# Altium project SB13ECU_EVL_V01_14031129.PrjPcb
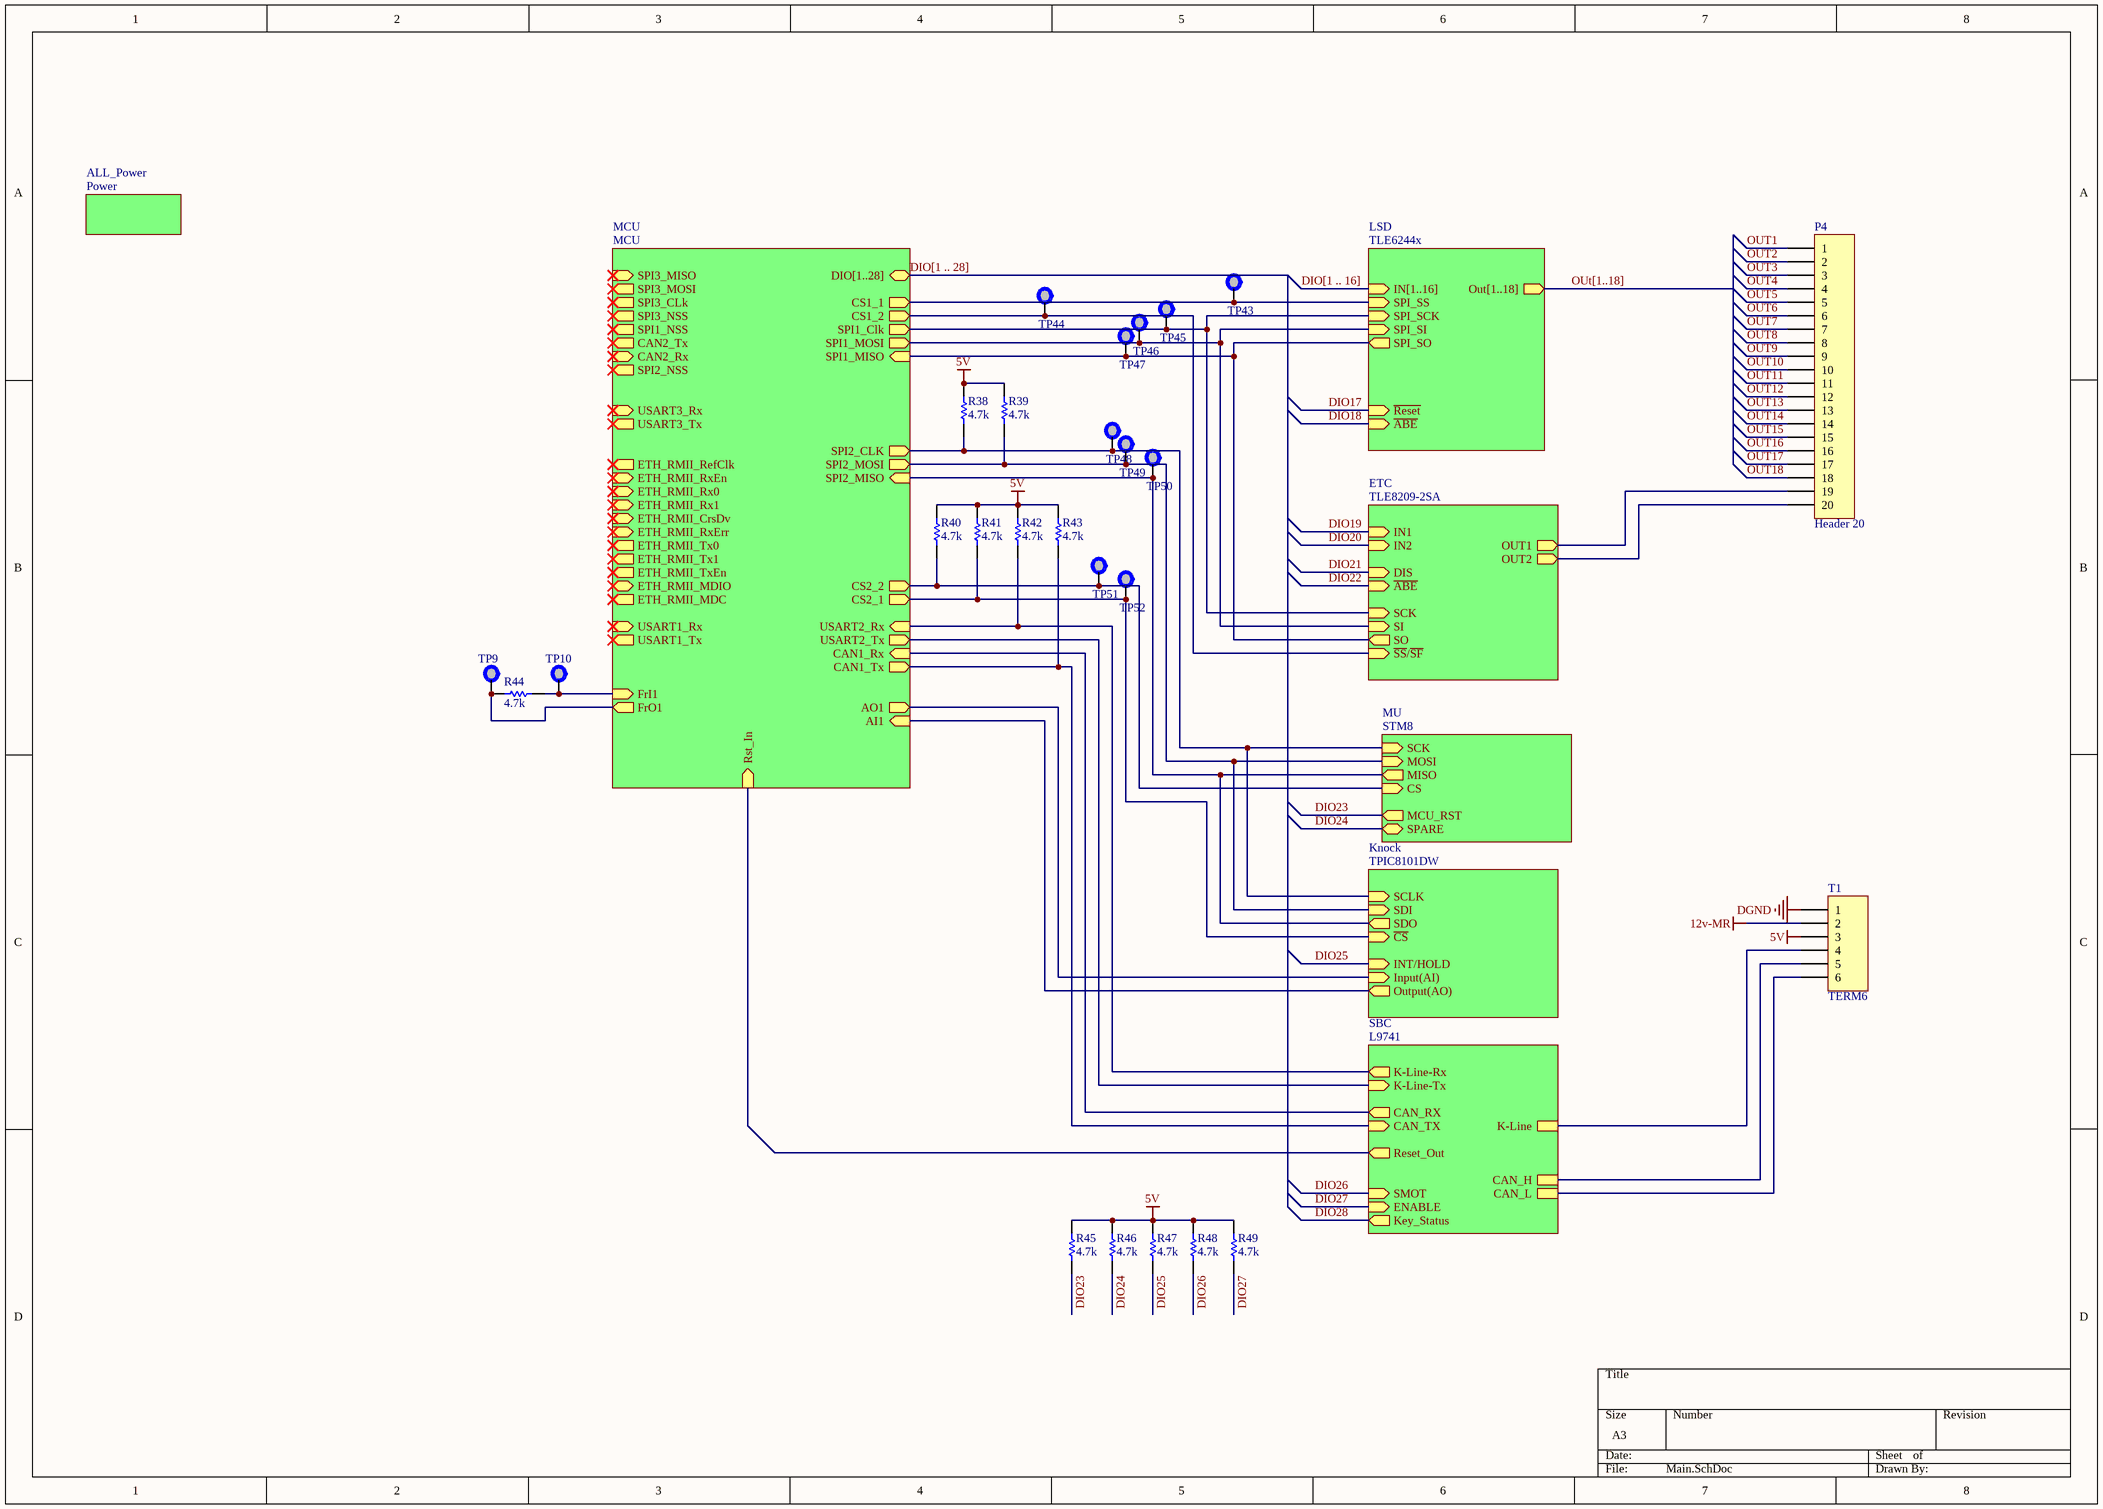
[diagram p0: Main.SchDoc]
8 sheets, 220 parts. Net scope: hierarchical (ports join the sheet entries above them; power ports are global).
Board file: SB13ECU_EVL_V01_14031129.PcbDoc
Sheets:
  Main.SchDoc
    MCU = MCU.SchDoc
    Knock = TPIC8101DW.SchDoc
    LSD = TLE6244x.SchDoc
    SBC = L9741.SchDoc
    ALL_Power = Power.SchDoc
    ETC = TLE8209-2SA.SchDoc
    MU = STM8.SchDoc

## Sheet Main.SchDoc
size A3; SheetNumber: 1; SheetTotal: 8; SPICEModelCacheTOCTCHPD: <root> / <DocumentId>TOCTCHPD</DocumentId> / </root>

### Parts
P4  Header 20  [HDR1X20]
R38  4.7K  [0805]
R39  4.7K  [0805]
R40  4.7K  [0805]
R41  4.7K  [0805]
R42  4.7K  [0805]
R43  4.7K  [0805]
R44  4.7K  [0805]
R45  4.7K  [0805]
R46  4.7K  [0805]
R47  4.7K  [0805]
R48  4.7K  [0805]
R49  4.7K  [0805]
T1  TERM6  [TERM6]
TP9  TestPoint  [TP]  (value not drawn)
TP10  TestPoint  [TP]  (value not drawn)
TP43  TestPoint  [TP]  (value not drawn)
TP44  TestPoint  [TP]  (value not drawn)
TP45  TestPoint  [TP]  (value not drawn)
TP46  TestPoint  [TP]  (value not drawn)
TP47  TestPoint  [TP]  (value not drawn)
TP48  TestPoint  [TP]  (value not drawn)
TP49  TestPoint  [TP]  (value not drawn)
TP50  TestPoint  [TP]  (value not drawn)
TP51  TestPoint  [TP]  (value not drawn)
TP52  TestPoint  [TP]  (value not drawn)

### Sub-sheets
ALL_Power = Power: no entries
ETC = TLE8209-2SA: IN1 (in), IN2 (in), DIS (in), ~{ABE} (in), SCK (in), SI (in), SO (out), ~{SS}/~{SF} (in), OUT1 (out), OUT2 (out)
Knock = TPIC8101DW: Output(AO) (out), SCLK (in), SDI (in), SDO (out), ~{CS} (in), INT/HOLD (in), Input(AI) (in)
LSD = TLE6244x: IN[1..16] (in), SPI_SS (in), SPI_SO (out), SPI_SCK (in), SPI_SI (in), ~{Reset} (in), ~{ABE} (in), Out[1..18] (out)
MCU = MCU: DIO[1..28] (bidir), ETH_RMII_RefClk (out), ETH_RMII_MDIO (bidir), ETH_RMII_CrsDv (in), ETH_RMII_RxErr (in), ETH_RMII_MDC (out), ETH_RMII_Rx0 (in), ETH_RMII_Rx1 (in), ETH_RMII_TxEn (out), ETH_RMII_RxEn (in), ETH_RMII_Tx0 (out), ETH_RMII_Tx1 (out), SPI1_Clk (out), SPI1_MISO (in), SPI1_MOSI (out), SPI1_NSS (out), SPI2_NSS (out), SPI2_CLK (out), SPI2_MOSI (out), SPI2_MISO (in), SPI3_MISO (in), SPI3_MOSI (out), SPI3_CLk (out), SPI3_NSS (out), CAN1_Rx (in), CAN1_Tx (out), CAN2_Tx (out), CAN2_Rx (in), USART1_Rx (in), USART1_Tx (out), USART2_Tx (out), USART2_Rx (in), USART3_Rx (in), USART3_Tx (out), AI1 (in), AO1 (out), CS1_1 (out), CS1_2 (out), CS2_1 (out), CS2_2 (out), Rst_In (in), FrI1 (in), FrO1 (out)
MU = STM8: SCK (in), MISO (out), MOSI (in), CS (in), MCU_RST (out), SPARE (bidir)
SBC = L9741: K-Line-Rx (out), K-Line-Tx (in), CAN_RX (out), CAN_TX (in), CAN_L, CAN_H, Reset_Out (out), SMOT (in), K-Line, ENABLE (in), Key_Status (out)

### Nets
5V: R38.2 R39.2 R40.1 R41.2 R42.2 R43.2 R45.1 R46.1 R47.1 R48.1 R49.1 T1.3
12v-MR: T1.2
DGND: T1.1
DIO23: R45.2 ; sheet MU/MCU_RST
DIO24: R46.2 ; sheet MU/SPARE
DIO25: R47.2 ; sheet Knock/INT/HOLD
DIO26: R48.2 ; sheet SBC/SMOT
DIO27: R49.2 ; sheet SBC/ENABLE
OUT1: P4.1
OUT2: P4.2
OUT3: P4.3
OUT4: P4.4
OUT5: P4.5
OUT6: P4.6
OUT7: P4.7
OUT8: P4.8
OUT9: P4.9
OUT10: P4.10
OUT11: P4.11
OUT12: P4.12
OUT13: P4.13
OUT14: P4.14
OUT15: P4.15
OUT16: P4.16
OUT17: P4.17
OUT18: P4.18
NetC25_1: sheet MCU/AO1, sheet Knock/Input(AI)
NetC32_1: T1.4 ; sheet SBC/K-Line
NetP4_19: P4.19 ; sheet ETC/OUT1
NetP4_20: P4.20 ; sheet ETC/OUT2
NetR2_1: sheet MCU/Rst_In, sheet SBC/Reset_Out
NetR17_1: sheet MCU/AI1, sheet Knock/Output(AO)
NetR38_1: R38.1 TP48.1 ; sheet MCU/SPI2_CLK, sheet Knock/SCLK, sheet MU/SCK
NetR39_1: R39.1 TP49.1 ; sheet MCU/SPI2_MOSI, sheet Knock/SDI, sheet MU/MOSI
NetR40_2: R40.2 TP51.1 ; sheet MCU/CS2_2, sheet MU/CS
NetR41_1: R41.1 TP52.1 ; sheet MCU/CS2_1, sheet Knock/~{CS}
NetR42_1: R42.1 ; sheet MCU/USART2_Rx, sheet SBC/K-Line-Rx
NetR43_1: R43.1 ; sheet MCU/CAN1_Tx, sheet SBC/CAN_TX
NetR44_1: R44.1 TP9.1 ; sheet MCU/FrO1
NetR44_2: R44.2 TP10.1 ; sheet MCU/FrI1
NetR57_2: T1.6 ; sheet SBC/CAN_L
NetR58_2: T1.5 ; sheet SBC/CAN_H
NetTP43_1: TP43.1 ; sheet MCU/CS1_1, sheet LSD/SPI_SS
NetTP44_1: TP44.1 ; sheet MCU/CS1_2, sheet ETC/~{SS}/~{SF}
NetTP45_1: TP45.1 ; sheet MCU/SPI1_Clk, sheet LSD/SPI_SCK, sheet ETC/SCK
NetTP46_1: TP46.1 ; sheet MCU/SPI1_MOSI, sheet LSD/SPI_SI, sheet ETC/SI
NetTP47_1: TP47.1 ; sheet MCU/SPI1_MISO, sheet LSD/SPI_SO, sheet ETC/SO
NetTP50_1: TP50.1 ; sheet MCU/SPI2_MISO, sheet Knock/SDO, sheet MU/MISO
NetTP54_1: sheet MCU/USART2_Tx, sheet SBC/K-Line-Tx
NetTP59_1: sheet MCU/CAN1_Rx, sheet SBC/CAN_RX

### Buses and harness runs
bus DIO[1 .. 16] = sheet LSD/IN[1..16]
bus DIO[1 .. 28] = sheet MCU/DIO[1..28]
bus OUt[1..18] = sheet LSD/Out[1..18]

### Library data of the parts
P4 = Header 20: Header, 20-Pin; LatestRevisionDate: 17-Jul-2002; LatestRevisionNote: Re-released for DXP Platform.; Publisher: Altium Limited
R38-R49 = Res1: Resistor; Published: 8-Jun-2000; LatestRevisionDate: 17-Jul-2002; LatestRevisionNote: Re-released for DXP Platform.; PackageReference: AXIAL-0.3; Publisher: Altium Limited; PackageDescription: Axial Device, Thru-Hole; 2 Leads; 0.3 in Pin Spacing; Value: 4.7k
T1 = MHDR1X6: Header, 6-Pin; LatestRevisionDate: 17-Jul-2002; LatestRevisionNote: Re-released for DXP Platform.; Publisher: Altium Limited

## Sheet MCU.SchDoc
size A4; SheetNumber: 2; SheetTotal: 8; SPICEModelCacheNGFSRWWY: <root> / <DocumentId>NGFSRWWY</DocumentId> / <CacheFrame Number="0"> / <Model Name="led0" Kind="MDL"> / <Text>*Typ INFRARED GaAs LED: Vf=1.2V Vr=5V If=40mA trr=3uS / *LED Pinout: 1=A, 2=K / .MODEL LED0 D (IS=93.5P RS=84M N=2.63 BV=5 IBV=10U / + CJO=2.97P VJ=.75 M=.333 TT=4.32U)</Text> / </Model> / <Model Name="dpsw2" Kind="CKT"> / <Text>* DIP switch 2 / * jjt 19/6/2002: created / * / *             Switch connections: / *             sw1 / *             |  |  sw2 / *             |  |  |  | / *             |  |  |  | / .subckt dpsw2 1  2  4  5 / + PARAMS: STATE1=0 STATE2=0 RON=1m ROFF=100E6 / * / V1 3 0 {STATE1} / V2 6 0 {STATE2} / * / SDIP1 1 2 3 0 DIPMOD / SDIP2 4 5 6 0 DIPMOD / * / .MODEL DIPMOD SW(VT=0.5 RON={RON} ROFF={ROFF}) / .ends dpsw2</Text> / </Model> / </CacheFrame> / </root>
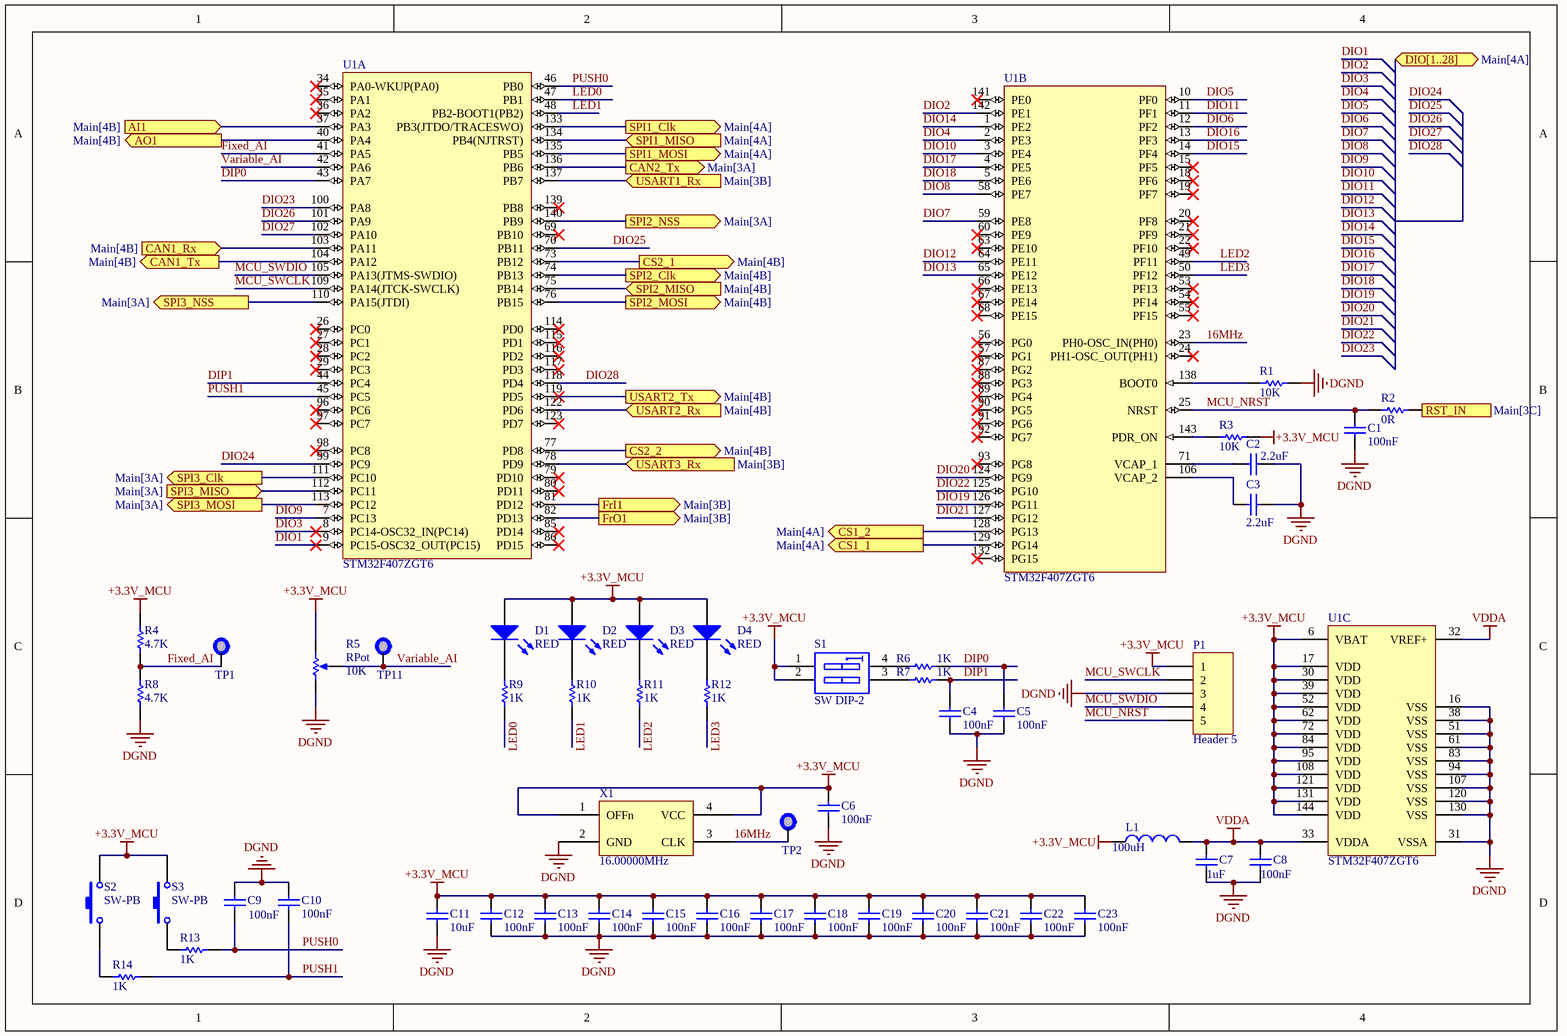
[diagram p1: MCU.SchDoc]

### Parts
C1  100nF  [0603c]
C2  2.2uF  [0805C]
C3  2.2uF  [0805C]
C4  100nF  [0603c]
C5  100nF  [0603c]
C6  100nF  [0603C]
C7  1uF  [0805C]
C8  100nF  [0603C]
C9  100nF  [0603c]
C10  100nF  [0603c]
C11  value 10uF  [1206C]  (hidden comment: 10uf/50V)
C12  100nF  [0603c]
C13  100nF  [0603c]
C14  100nF  [0603c]
C15  100nF  [0603c]
C16  100nF  [0603c]
C17  100nF  [0603c]
C18  100nF  [0603c]
C19  100nF  [0603c]
C20  100nF  [0603c]
C21  100nF  [0603c]
C22  100nF  [0603c]
C23  100nF  [0603c]
D1  RED  [0805LED]
D2  RED  [0805LED]
D3  RED  [0805LED]
D4  RED  [0805LED]
L1  100uH  [0805FB]
P1  Header 5  [HDR1X5]
R1  10K  [0805]
R2  0R  [0805]
R3  10K  [0805]
R4  4.7K  [0805]
R5  RPot  value 10K  [POT-MULTITURN]
R6  1K  [0805]
R7  1K  [0805]
R8  4.7K  [0805]
R9  1K  [0805]
R10  1K  [0805]
R11  1K  [0805]
R12  1K  [0805]
R13  1K  [0805]
R14  1K  [0805]
S1  SW DIP-2  [DIP-4]
S2  SW-PB  [PUSHBUTTON-SMD]
S3  SW-PB  [PUSHBUTTON-SMD]
TP1  TestPoint  [TP]  (value not drawn)
TP2  TestPoint  [TP]  (value not drawn)
TP11  TestPoint  [TP]  (value not drawn)
U1  STM32F407ZGT6  [STM-LQFP144_N]  (parts A,B,C of 3)
X1  value 16.00000MHz  [OSC-SMT]  (hidden comment: SG-8018CB 16.000000 MHZ TJHPA)

### Ports
AI1 (in, see Main[4B]), AO1 (out, see Main[4B]), CAN1_Rx (in, see Main[4B]), CAN1_Tx (out, see Main[4B]), CAN2_Tx (out, see Main[3A]), CS1_1 (out, see Main[4A]), CS1_2 (out, see Main[4A]), CS2_1 (out, see Main[4B]), CS2_2 (out, see Main[4B]), DIO[1..28] (bidir, see Main[4A]), FrI1 (out, see Main[3B]), FrO1 (out, see Main[3B]), RST_IN (in, see Main[3C]), SPI1_Clk (out, see Main[4A]), SPI1_MISO (in, see Main[4A]), SPI1_MOSI (out, see Main[4A]), SPI2_Clk (out, see Main[4B]), SPI2_MISO (in, see Main[4B]), SPI2_MOSI (out, see Main[4B]), SPI2_NSS (out, see Main[3A]), SPI3_Clk (out, see Main[3A]), SPI3_MISO (in, see Main[3A]), SPI3_MOSI (out, see Main[3A]), SPI3_NSS (out, see Main[3A]), USART1_Rx (in, see Main[3B]), USART2_Rx (in, see Main[4B]), USART2_Tx (out, see Main[4B]), USART3_Rx (in, see Main[3B])

### Nets
+3.3V_MCU: C6.1 C11.2 C12.1 C13.1 C14.1 C15.1 C16.1 C17.1 C18.1 C19.1 C20.1 C21.1 C22.1 C23.1 D1.1(A) D2.1(A) D3.1(A) D4.1(A) L1.1 P1.1 R3.1 R4.2 R5.3(BOT) S1.1(A1) S1.2(A2) S2.2 S3.2 U1.6(VBAT) U1.17(VDD) U1.30(VDD) U1.39(VDD) U1.52(VDD) U1.62(VDD) U1.72(VDD) U1.84(VDD) U1.95(VDD) U1.108(VDD) U1.121(VDD) U1.131(VDD) U1.144(VDD) X1.1(OFFn) X1.4(VCC)
DGND: C1.2 C2.2 C3.2 C4.2 C5.2 C6.2 C7.1 C8.1 C9.1 C10.1 C11.1 C12.2 C13.2 C14.2 C15.2 C16.2 C17.2 C18.2 C19.2 C20.2 C21.2 C22.2 C23.2 P1.3 R1.1 R5.1(TOP) R8.1 U1.16(VSS) U1.31(VSSA) U1.38(VSS) U1.51(VSS) U1.61(VSS) U1.83(VSS) U1.94(VSS) U1.107(VSS) U1.120(VSS) U1.130(VSS) X1.2(GND)
VDDA: C7.2 C8.2 L1.2 U1.32(VREF+) U1.33(VDDA)
16MHz: TP2.1 U1.23(PH0-OSC_IN(PH0)) X1.3(CLK)
DIO1: U1.9(PC15-OSC32_OUT(PC15))
DIO2: U1.142(PE1)
DIO3: U1.8(PC14-OSC32_IN(PC14))
DIO4: U1.2(PE3)
DIO5: U1.10(PF0)
DIO6: U1.12(PF2)
DIO7: U1.59(PE8)
DIO8: U1.58(PE7)
DIO9: U1.7(PC13)
DIO10: U1.3(PE4)
DIO11: U1.11(PF1)
DIO12: U1.64(PE11)
DIO13: U1.65(PE12)
DIO14: U1.1(PE2)
DIO15: U1.14(PF4)
DIO16: U1.13(PF3)
DIO17: U1.4(PE5)
DIO18: U1.5(PE6)
DIO19: U1.126(PG11)
DIO20: U1.124(PG9)
DIO21: U1.127(PG12)
DIO22: U1.125(PG10)
DIO23: U1.100(PA8)
DIO24: U1.99(PC9)
DIO25: U1.70(PB11)
DIO26: U1.101(PA9)
DIO27: U1.102(PA10)
DIO28: U1.118(PD4)
DIP0: C5.1 R6.2 U1.43(PA7)
DIP1: C4.1 R7.2 U1.44(PC4)
Fixed_AI: R4.1 R8.2 TP1.1 U1.41(PA5)
LED0: R9.1 U1.47(PB1)
LED1: R10.1 U1.48(PB2-BOOT1(PB2))
LED2: R11.1 U1.49(PF11)
LED3: R12.1 U1.50(PF12)
MCU_NRST: C1.1 P1.5 R2.2 U1.25(NRST)
MCU_SWCLK: P1.2 U1.109(PA14(JTCK-SWCLK))
MCU_SWDIO: P1.4 U1.105(PA13(JTMS-SWDIO))
PUSH0: C9.2 R13.2 U1.46(PB0)
PUSH1: C10.2 R14.1 U1.45(PC5)
Variable_AI: R5.2(TAP) TP11.1 U1.42(PA6)
NetC2_1: C2.1 U1.71(VCAP_1)
NetC3_1: C3.1 U1.106(VCAP_2)
NetC25_1: U1.40(PA4) ; port AO1
NetD1_2: D1.2(K) R9.2
NetD2_2: D2.2(K) R10.2
NetD3_2: D3.2(K) R11.2
NetD4_2: D4.2(K) R12.2
NetR1_2: R1.2 U1.138(BOOT0)
NetR2_1: R2.1 ; port RST_IN
NetR3_2: R3.2 U1.143(PDR_ON)
NetR6_1: R6.1 S1.4(B1)
NetR7_1: R7.1 S1.3(B2)
NetR13_1: R13.1 S3.1
NetR14_2: R14.2 S2.1
NetR17_1: U1.37(PA3) ; port AI1
NetR38_1: U1.74(PB13) ; port SPI2_Clk
NetR39_1: U1.76(PB15) ; port SPI2_MOSI
NetR40_2: U1.77(PD8) ; port CS2_2
NetR41_1: U1.73(PB12) ; port CS2_1
NetR42_1: U1.122(PD6) ; port USART2_Rx
NetR43_1: U1.104(PA12) ; port CAN1_Tx
NetR44_1: U1.82(PD13) ; port FrO1
NetR44_2: U1.81(PD12) ; port FrI1
NetTP43_1: U1.129(PG14) ; port CS1_1
NetTP44_1: U1.128(PG13) ; port CS1_2
NetTP45_1: U1.133(PB3(JTDO/TRACESWO)) ; port SPI1_Clk
NetTP46_1: U1.135(PB5) ; port SPI1_MOSI
NetTP47_1: U1.134(PB4(NJTRST)) ; port SPI1_MISO
NetTP50_1: U1.75(PB14) ; port SPI2_MISO
NetTP54_1: U1.119(PD5) ; port USART2_Tx
NetTP59_1: U1.103(PA11) ; port CAN1_Rx
NetU1_78: U1.78(PD9) ; port USART3_Rx
NetU1_110: U1.110(PA15(JTDI)) ; port SPI3_NSS
NetU1_111: U1.111(PC10) ; port SPI3_Clk
NetU1_112: U1.112(PC11) ; port SPI3_MISO
NetU1_113: U1.113(PC12) ; port SPI3_MOSI
NetU1_136: U1.136(PB6) ; port CAN2_Tx
NetU1_137: U1.137(PB7) ; port USART1_Rx
NetU1_140: U1.140(PB9) ; port SPI2_NSS

Not connected (* = marked no-connect by the designer): U1 15(PF5)* 18(PF6)* 19(PF7)* 20(PF8)* 21(PF9)* 22(PF10)* 24(PH1-OSC_OUT(PH1))* 26(PC0)* 27(PC1)* 28(PC2)* 29(PC3)* 34(PA0-WKUP(PA0))* 35(PA1)* 36(PA2)* 53(PF13)* 54(PF14)* 55(PF15)* 56(PG0)* 57(PG1)* 60(PE9)* 63(PE10)* 66(PE13)* 67(PE14)* 68(PE15)* 69(PB10)* 79(PD10)* 80(PD11)* 85(PD14)* 86(PD15)* 87(PG2)* 88(PG3)* 89(PG4)* 90(PG5)* 91(PG6)* 92(PG7)* 93(PG8)* 96(PC6)* 97(PC7)* 98(PC8)* 114(PD0)* 115(PD1)* 116(PD2)* 117(PD3)* 123(PD7)* 132(PG15)* 139(PB8)* 141(PE0)*

### Library data of the parts
C1-C23 = Cap: LOW ESR; Published: 8-Jun-2000; LatestRevisionDate: 17-Jul-2002; LatestRevisionNote: Re-released for DXP Platform.; PackageReference: RAD-0.3; Publisher: Altium Limited; PackageDescription: Radial Cap, Thru-Hole; 2 Leads; 0.3 in Pin Spacing
  C1 C4-C6 C8-C10 C12-C23: Value: 100nF
  C2 C3: Value: 2.2uF
  C7: Value: 1uF
D1-D4 = LED0: Published: 8-Jun-2000; LatestRevisionDate: 08-Jul-2005; LatestRevisionNote: Mech Layer 1 removed.; PackageReference: LED-0; Publisher: Altium Limited; PackageDescription: LED; 2 Leads
L1 = Inductor: Code_IEC: 1005; Value: BEAD(FCM1608KF-601T03); Published: 8-Jun-2000; LatestRevisionDate: 29-May-2009; LatestRevisionNote: IPC-7351 Footprint Added.; PackageReference: 0402-A; Publisher: Altium Limited; PackageDescription: Chip Inductor; Code_JEITA: 0402
P1 = Header 5: Header, 5-Pin; LatestRevisionDate: 17-Jul-2002; LatestRevisionNote: Re-released for DXP Platform.; Publisher: Altium Limited
R1-R4 R6-R14 = Res1: Resistor; Published: 8-Jun-2000; LatestRevisionDate: 17-Jul-2002; LatestRevisionNote: Re-released for DXP Platform.; PackageReference: AXIAL-0.3; Publisher: Altium Limited; PackageDescription: Axial Device, Thru-Hole; 2 Leads; 0.3 in Pin Spacing
  R1 R3: Value: 10K
  R2: Value: 0R
  R4 R8: Value: 4.7K
  R6 R7 R9-R14: Value: 1K
R5 = RPot: MultiTurn; Sim Note: Enter the Resistance value and the set point into parameter fields.; Set Position: 0.5; Published: 8-Jun-2000; LatestRevisionDate: 17-Jul-2002; LatestRevisionNote: Re-released for DXP Platform.; PackageReference: VR5; Publisher: Altium Limited; PackageDescription: Variable Resistor, Thru-Hole; 3 Leads
S1 = SW DIP-2: DIP Switch, 2 Position, SPST; Published: 24-Mar-1999; LatestRevisionDate: 17-Jul-2002; LatestRevisionNote: Re-released for DXP Platform.; PackageReference: DIP-4; Publisher: Altium Limited
S2 S3 = SW-PB: Switch; Published: 24-Mar-1999; LatestRevisionDate: 17-Jul-2002; LatestRevisionNote: Re-released for DXP Platform.; PackageReference: SPST-2; Publisher: Altium Limited; PackageDescription: Switch; 2 Leads
U1 = STM32F407ZGT6: ARM Cortex-M4 32-bit MCU+FPU, 210 DMIPS, 1024 kB Flash, 192 kB Internal RAM, 114 I/Os, 144-pin LQFP, -40 to 85 degC, Tray; Manufacturer: STMicroelectronics; D/A Converter: 2x12-bit; FLASH Size (Prog) (kB): 1024; I/Os (High Current): 114; Internal RAM Size (kB): 192; Operating Frequency(F) (Processor speed) (MHz): 168; Supply Voltage(Vcc) max (V): 3.6; Supply Voltage(Vcc) min (V): 1.8; DatasheetVersion: Rev. 4; PackageVersion: Rev. 4, 06/2013; PackageReference: LQFP144; PackageDescription: 144-Pin Low Profile Quad Flat Package, 20 x 20 mm Body, 0.5 mm Pitch; Supplier 1: Digi-Key; Supplier Part Number 1: 497-11766-ND; Supplier 2: Newark; Supplier Part Number 2: 73T2334; Supplier 3: Mouser; Supplier Part Number 3: 511-STM32F407ZGT6; Core: ARM Cortex-M4; Packing: Tray; Mounting Technology: Surface Mount; PartNumber: STM32F407ZGT6; ComponentLink1Description: Manufacturer URL; ComponentLink1URL: http://www.st.com/web/en/home.html; ComponentLink2Description: Datasheet; ComponentLink2URL: http://www.st.com/st-web-ui/static/active/en/resource/technical/document/datasheet/DM00037051.pdf; ComponentLink3Description: Package Specification; ComponentLink3URL: http://www.st.com/st-web-ui/static/active/en/resource/technical/document/datasheet/DM00037051.pdf
X1 = Oscillator

## Sheet TPIC8101DW.SchDoc
size A4; SheetNumber: 3; SheetTotal: 8; SPICEModelCacheOGXEDZQU: <root> / <DocumentId>OGXEDZQU</DocumentId> / <CacheFrame Number="0"> / <Model Name="xtal" Kind="CKT"> / <Text>*Generic type:crystal pkg:HC33/51 / .SUBCKT XTAL 1 2 PARAMS: FREQ=1Meg RS=750 C=13pf Q=1000 / LX 1 3 {((Q*RS)/(6.2831852*FREQ))} IC=0.5M / CX 3 4 {(1/(Q*6.2831852*FREQ*RS))} / C0 1 2 {C} / RS 4 2 {RS} / .ENDS XTAL</Text> / </Model> / </CacheFrame> / </root>
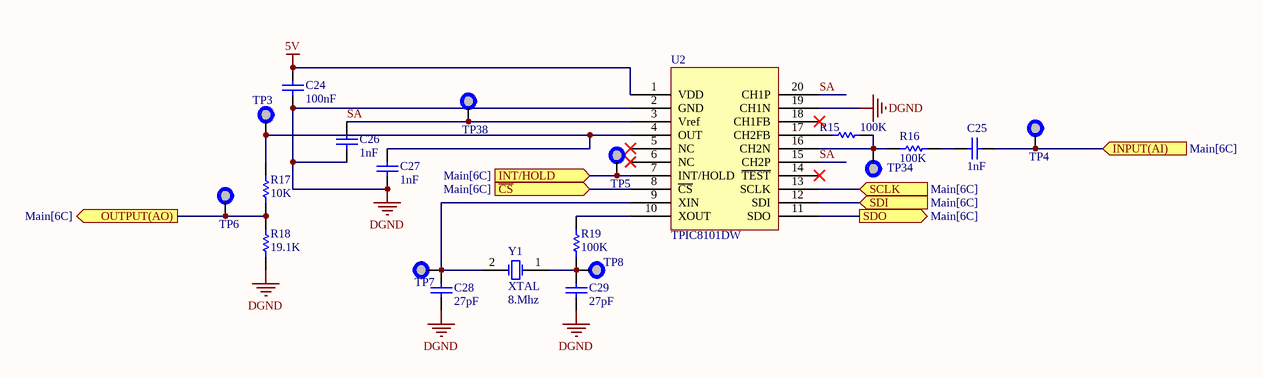
[diagram p2: TPIC8101DW.SchDoc]

### Parts
C24  100nF  [0603c]
C25  1nF  [0805C]
C26  1nF  [0805C]
C27  1nF  [0805C]
C28  value 27pF  [0805C]  (hidden comment: 1nF)
C29  27pF  [0805C]
R15  100K  [0805]
R16  100K  [0805]
R17  10K  [0805]
R18  19.1K  [0805]
R19  100K  [0805]
TP3  TestPoint  [TP]  (value not drawn)
TP4  TestPoint  [TP]  (value not drawn)
TP5  TestPoint  [TP]  (value not drawn)
TP6  TestPoint  [TP]  (value not drawn)
TP7  TestPoint  [TP]  (value not drawn)
TP8  TestPoint  [TP]  (value not drawn)
TP34  TestPoint  [TP]  (value not drawn)
TP38  TestPoint  [TP]  (value not drawn)
U2  TPIC8101DW  [SOIC-20]
Y1  XTAL  value 8.Mhz  [XTAL]

### Ports
INPUT(AI) (in, see Main[6C]), INT/HOLD (in, see Main[6C]), OUTPUT(AO) (out, see Main[6C]), SCLK (in, see Main[6C]), SDI (in, see Main[6C]), SDO (out, see Main[6C]), ~{CS} (in, see Main[6C])

### Nets
5V: C24.1 U2.1(VDD)
DGND: C24.2 C26.1 C27.1 C28.2 C29.2 R18.1 U2.2(GND) U2.19(CH1N)
DIO25: TP5.1 U2.7(INT/HOLD) ; port INT/HOLD
SA: C26.2 TP38.1 U2.3(Vref) U2.15(CH2P) U2.20(CH1P)
NetC25_1: C25.1 TP4.1 ; port INPUT(AI)
NetC25_2: C25.2 R16.2
NetC27_2: C27.2 R17.2 TP3.1 U2.4(OUT)
NetC28_1: C28.1 TP7.1 U2.9(XIN) Y1.2(OSC2)
NetC29_1: C29.1 R19.1 TP8.1 Y1.1(OSC1)
NetR15_1: R15.1 U2.17(CH2FB)
NetR15_2: R15.2 R16.1 TP34.1 U2.16(CH2N)
NetR17_1: R17.1 R18.2 TP6.1 ; port OUTPUT(AO)
NetR19_2: R19.2 U2.10(XOUT)
NetR38_1: U2.13(SCLK) ; port SCLK
NetR39_1: U2.12(SDI) ; port SDI
NetR41_1: U2.8(~{CS}) ; port ~{CS}
NetTP50_1: U2.11(SDO) ; port SDO

Not connected (* = marked no-connect by the designer): U2 5(NC)* 6(NC)* 14(~{TEST})* 18(CH1FB)*

### Library data of the parts
C24-C29 = Cap: LOW ESR; Published: 8-Jun-2000; LatestRevisionDate: 17-Jul-2002; LatestRevisionNote: Re-released for DXP Platform.; PackageReference: RAD-0.3; Publisher: Altium Limited; PackageDescription: Radial Cap, Thru-Hole; 2 Leads; 0.3 in Pin Spacing
  C24: Value: 100nF
  C25-C27: Value: 1nF
  C29: Value: 27pF
R15-R19 = Res1: Resistor; Published: 8-Jun-2000; LatestRevisionDate: 17-Jul-2002; LatestRevisionNote: Re-released for DXP Platform.; PackageReference: AXIAL-0.3; Publisher: Altium Limited; PackageDescription: Axial Device, Thru-Hole; 2 Leads; 0.3 in Pin Spacing
  R15 R16 R19: Value: 100K
  R17: Value: 10K
  R18: Value: 19.1K
U2 = TPIC8101DW: Knock, SO20; Manufacturer: TI; Code: 301; Part Number: TPIC8101DW; Type: Knock Sensor Interface; Features: Dual-Channel Knock Sensor Interface; Package: SO20
Y1 = XTAL: Crystal Oscillator; Published: 8-Jun-2000; LatestRevisionDate: 17-Jul-2002; LatestRevisionNote: Re-released for DXP Platform.; PackageReference: R38; Publisher: Altium Limited; PackageDescription: Crystal, Thru-Hole; 2 Leads; Body 3.1 x 8.2 mm (Dia.xH)

## Sheet TLE6244x.SchDoc
size A4; SheetNumber: 4; SheetTotal: 8
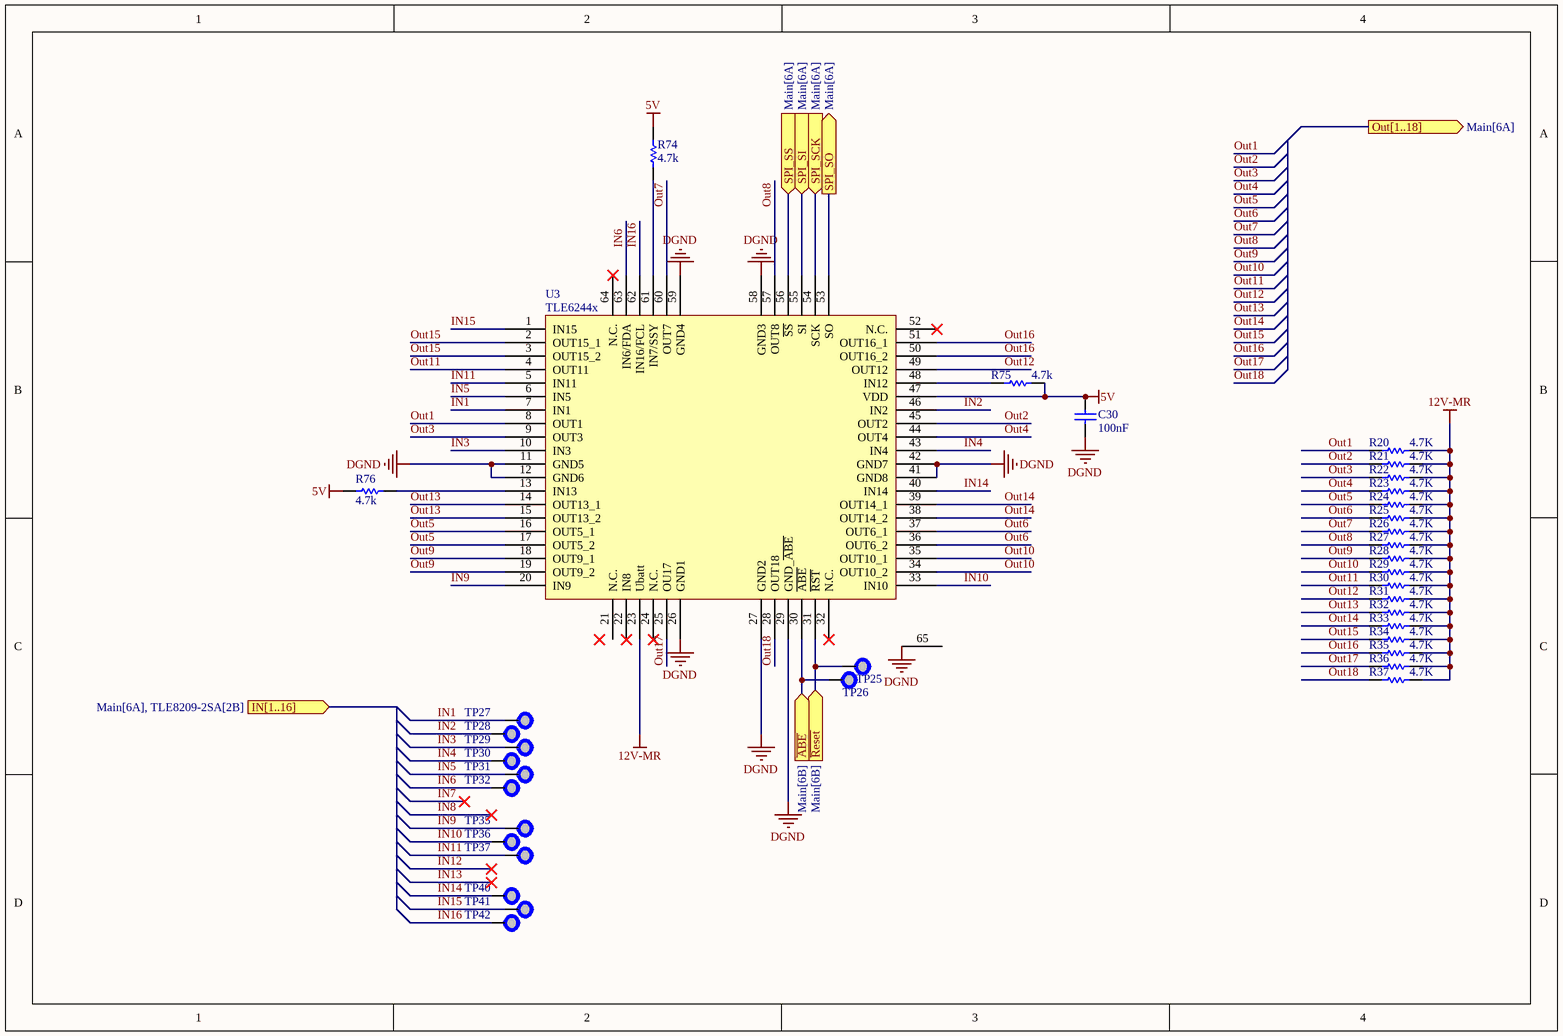
[diagram p3: TLE6244x.SchDoc]

### Parts
C30  100nF  [0603c]
R20  4.7K  [0805]
R21  4.7K  [0805]
R22  4.7K  [0805]
R23  4.7K  [0805]
R24  4.7K  [0805]
R25  4.7K  [0805]
R26  4.7K  [0805]
R27  4.7K  [0805]
R28  4.7K  [0805]
R29  4.7K  [0805]
R30  4.7K  [0805]
R31  4.7K  [0805]
R32  4.7K  [0805]
R33  4.7K  [0805]
R34  4.7K  [0805]
R35  4.7K  [0805]
R36  4.7K  [0805]
R37  4.7K  [0805]
R74  4.7K  [0805]
R75  4.7K  [0805]
R76  4.7K  [0805]
TP25  TestPoint  [TP]  (value not drawn)
TP26  TestPoint  [TP]  (value not drawn)
TP27  TestPoint  [TP]  (value not drawn)
TP28  TestPoint  [TP]  (value not drawn)
TP29  TestPoint  [TP]  (value not drawn)
TP30  TestPoint  [TP]  (value not drawn)
TP31  TestPoint  [TP]  (value not drawn)
TP32  TestPoint  [TP]  (value not drawn)
TP35  TestPoint  [TP]  (value not drawn)
TP36  TestPoint  [TP]  (value not drawn)
TP37  TestPoint  [TP]  (value not drawn)
TP40  TestPoint  [TP]  (value not drawn)
TP41  TestPoint  [TP]  (value not drawn)
TP42  TestPoint  [TP]  (value not drawn)
U3  TLE6244x  [TLE6244]

### Ports
IN[1..16] (in, see Main[6A], TLE8209-2SA[2B]), Out[1..18] (out, see Main[6A]), SPI_SCK (in, see Main[6A]), SPI_SI (in, see Main[6A]), SPI_SO (out, see Main[6A]), SPI_SS (in, see Main[6A]), ~{ABE} (in, see Main[6B]), ~{Reset} (in, see Main[6B])

### Nets
5V: C30.1 R74.2 R75.1 R76.2 U3.47(VDD)
12v-MR: R20.1 R21.1 R22.1 R23.1 R24.1 R25.1 R26.1 R27.1 R28.1 R29.1 R30.1 R31.1 R32.1 R33.1 R34.1 R35.1 R36.1 R37.1 U3.23(Ubatt)
DGND: C30.2 U3.11(GND5) U3.12(GND6) U3.26(GND1) U3.27(GND2) U3.29(GND_~{ABE}) U3.41(GND8) U3.42(GND7) U3.58(GND3) U3.59(GND4) U3.65(DGND)
DIO17: TP25.1 U3.31(~{RST}) ; port ~{Reset}
DIO18: TP26.1 U3.30(~{ABE}) ; port ~{ABE}
IN1: TP27.1 U3.7(IN1)
IN2: TP28.1 U3.46(IN2)
IN3: TP29.1 U3.10(IN3)
IN4: TP30.1 U3.43(IN4)
IN5: TP31.1 U3.6(IN5)
IN6: TP32.1 U3.63(IN6/FDA)
IN9: TP35.1 U3.20(IN9)
IN10: TP36.1 U3.33(IN10)
IN11: TP37.1 U3.5(IN11)
IN14: TP40.1 U3.40(IN14)
IN15: TP41.1 U3.1(IN15)
IN16: TP42.1 U3.62(IN16/FCL)
Out1: R20.2 U3.8(OUT1)
Out2: R21.2 U3.45(OUT2)
Out3: R22.2 U3.9(OUT3)
Out4: R23.2 U3.44(OUT4)
Out5: R24.2 U3.16(OUT5_1) U3.17(OUT5_2)
Out6: R25.2 U3.36(OUT6_2) U3.37(OUT6_1)
Out7: R26.2 U3.60(OUT7)
Out8: R27.2 U3.57(OUT8)
Out9: R28.2 U3.18(OUT9_1) U3.19(OUT9_2)
Out10: R29.2 U3.34(OUT10_2) U3.35(OUT10_1)
Out11: R30.2 U3.4(OUT11)
Out12: R31.2 U3.49(OUT12)
Out13: R32.2 U3.14(OUT13_1) U3.15(OUT13_2)
Out14: R33.2 U3.38(OUT14_2) U3.39(OUT14_1)
Out15: R34.2 U3.2(OUT15_1) U3.3(OUT15_2)
Out16: R35.2 U3.50(OUT16_2) U3.51(OUT16_1)
Out17: R36.2 U3.25(OU17)
Out18: R37.2 U3.28(OUT18)
NetR74_1: R74.1 U3.61(IN7/SSY)
NetR75_2: R75.2 U3.48(IN12)
NetR76_1: R76.1 U3.13(IN13)
NetTP43_1: U3.56(~{SS}) ; port SPI_SS
NetTP45_1: U3.54(SCK) ; port SPI_SCK
NetTP46_1: U3.55(SI) ; port SPI_SI
NetTP47_1: U3.53(SO) ; port SPI_SO

Not connected (* = marked no-connect by the designer): U3 21(N.C.) 22(IN8)* 24(N.C.)* 32(N.C.)* 52(N.C.)* 64(N.C.)*

### Library data of the parts
C30 = Cap: LOW ESR; Published: 8-Jun-2000; LatestRevisionDate: 17-Jul-2002; LatestRevisionNote: Re-released for DXP Platform.; PackageReference: RAD-0.3; Publisher: Altium Limited; PackageDescription: Radial Cap, Thru-Hole; 2 Leads; 0.3 in Pin Spacing; Value: 100nF
R20-R37 R74-R76 = Res1: Resistor; Published: 8-Jun-2000; LatestRevisionDate: 17-Jul-2002; LatestRevisionNote: Re-released for DXP Platform.; PackageReference: AXIAL-0.3; Publisher: Altium Limited; PackageDescription: Axial Device, Thru-Hole; 2 Leads; 0.3 in Pin Spacing
  R20-R37: Value: 4.7K
  R74-R76: Value: 4.7k
U3 = TLE6244x: PG-MQFP-64-10; Manufacturer: Infineon; Code: 12; Priority: 1; Package: PG-MQFP-64-10; Part Number: TLE6244X; Type: 18 Channel Smart Lowside Switch; Features: AEC Qualified

## Sheet L9741.SchDoc
size A4; SheetNumber: 5; SheetTotal: 8; SPICEModelCacheKCFYWLGF: <root> / <DocumentId>KCFYWLGF</DocumentId> / <CacheFrame Number="0"> / <Model Name="dpsw2" Kind="CKT"> / <Text>* DIP switch 2 / * jjt 19/6/2002: created / * / *             Switch connections: / *             sw1 / *             |  |  sw2 / *             |  |  |  | / *             |  |  |  | / .subckt dpsw2 1  2  4  5 / + PARAMS: STATE1=0 STATE2=0 RON=1m ROFF=100E6 / * / V1 3 0 {STATE1} / V2 6 0 {STATE2} / * / SDIP1 1 2 3 0 DIPMOD / SDIP2 4 5 6 0 DIPMOD / * / .MODEL DIPMOD SW(VT=0.5 RON={RON} ROFF={ROFF}) / .ends dpsw2</Text> / </Model> / </CacheFrame> / </root>
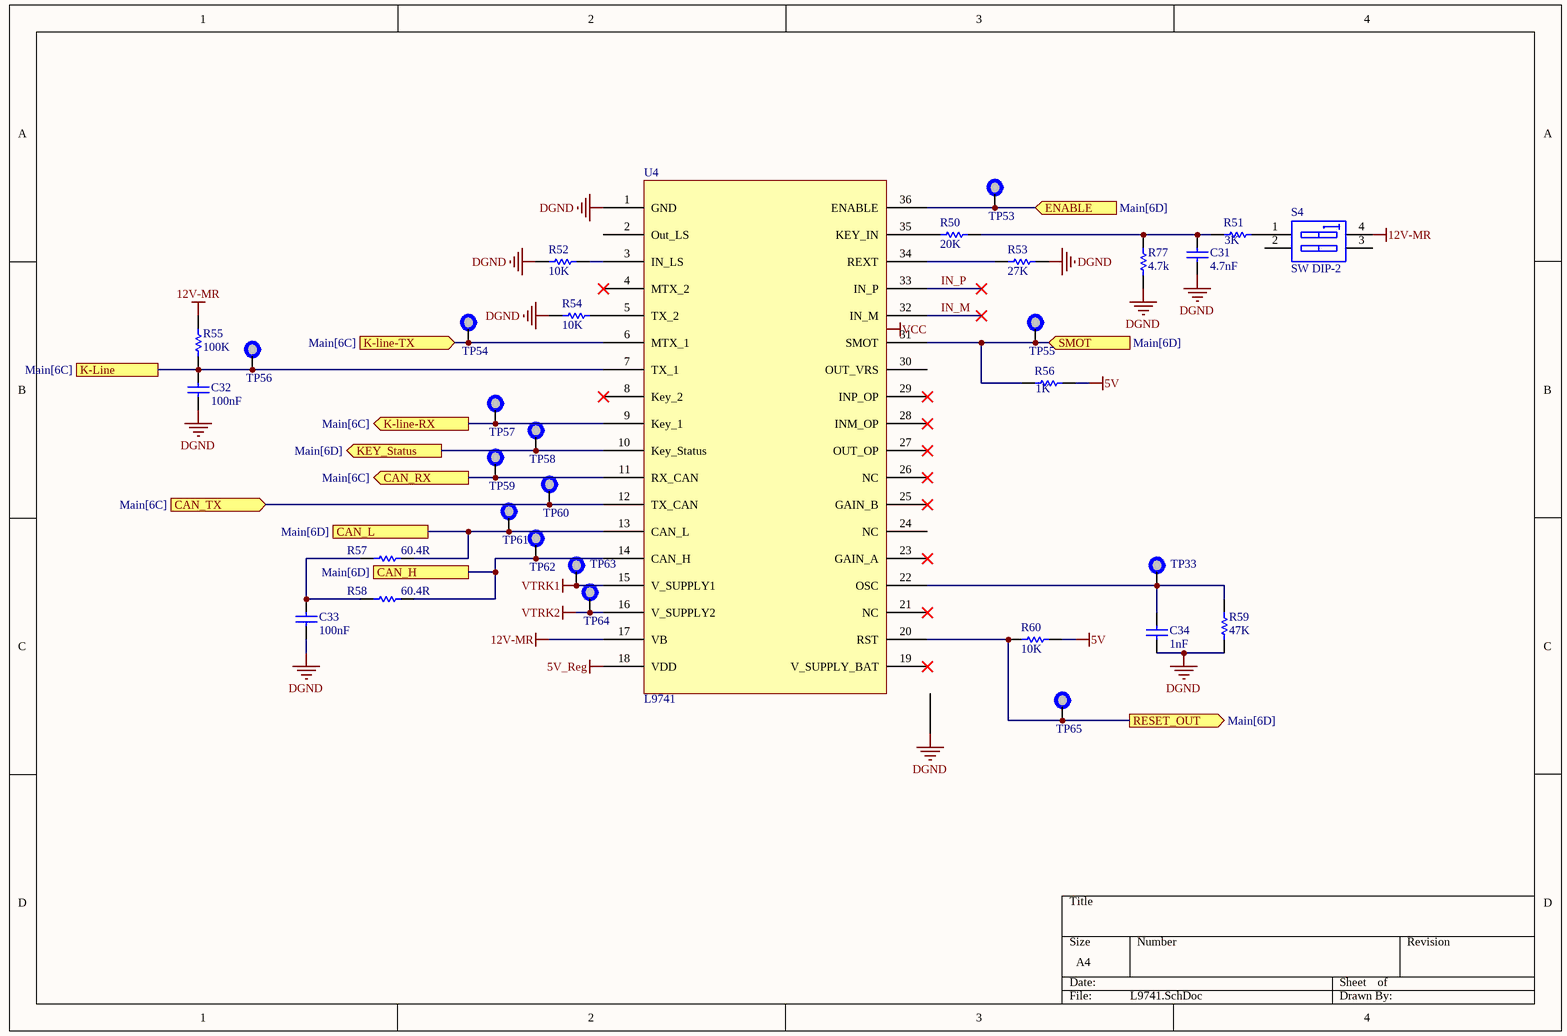
[diagram p4: L9741.SchDoc]

### Parts
C31  4.7nF  [0805C]
C32  100nF  [0603c]
C33  100nF  [0603c]
C34  1nF  [0805C]
R50  20K  [0805]
R51  3K  [0805]
R52  10K  [0805]
R53  27K  [0805]
R54  10K  [0805]
R55  100K  [0805]
R56  1K  [0805]
R57  60.4R  [1206]
R58  60.4R  [1206]
R59  47K  [0805]
R60  10K  [0805]
R77  4.7K  [0805]
S4  SW DIP-2  [DIP-4]
TP33  TestPoint  [TP]  (value not drawn)
TP53  TestPoint  [TP]  (value not drawn)
TP54  TestPoint  [TP]  (value not drawn)
TP55  TestPoint  [TP]  (value not drawn)
TP56  TestPoint  [TP]  (value not drawn)
TP57  TestPoint  [TP]  (value not drawn)
TP58  TestPoint  [TP]  (value not drawn)
TP59  TestPoint  [TP]  (value not drawn)
TP60  TestPoint  [TP]  (value not drawn)
TP61  TestPoint  [TP]  (value not drawn)
TP62  TestPoint  [TP]  (value not drawn)
TP63  TestPoint  [TP]  (value not drawn)
TP64  TestPoint  [TP]  (value not drawn)
TP65  TestPoint  [TP]  (value not drawn)
U4  L9741  [L9741]

### Ports
CAN_H (see Main[6D]), CAN_L (see Main[6D]), CAN_RX (out, see Main[6C]), CAN_TX (in, see Main[6C]), ENABLE (in, see Main[6D]), K-Line (see Main[6C]), K-line-RX (out, see Main[6C]), K-line-TX (in, see Main[6C]), KEY_Status (out, see Main[6D]), RESET_OUT (out, see Main[6D]), SMOT (in, see Main[6D])

### Nets
5V: R56.2 R60.1
5V_Reg: U4.18(VDD)
12v-MR: R55.1 S4.4(B1) U4.17(VB)
DGND: C31.1 C32.2 C33.2 C34.2 R52.2 R53.1 R54.2 R59.2 R77.1 U4.1(GND) U4.37(GND)
VTRK1: TP63.1 U4.15(V_SUPPLY1)
VTRK2: TP64.1 U4.16(V_SUPPLY2)
DIO26: R56.1 TP55.1 U4.31(SMOT) ; port SMOT
DIO27: TP53.1 U4.36(ENABLE) ; port ENABLE
DIO28: TP58.1 U4.10(Key_Status) ; port KEY_Status
IN_M: U4.32(IN_M)
IN_P: U4.33(IN_P)
NetC31_2: C31.2 R50.1 R51.1 R77.2
NetC32_1: C32.1 R55.2 TP56.1 U4.7(TX_1) ; port K-Line
NetC33_1: C33.1 R57.1 R58.1
NetC34_1: C34.1 R59.1 TP33.1 U4.22(OSC)
NetR2_1: R60.2 TP65.1 U4.20(RST) ; port RESET_OUT
NetR42_1: TP57.1 U4.9(Key_1) ; port K-line-RX
NetR43_1: TP60.1 U4.12(TX_CAN) ; port CAN_TX
NetR50_2: R50.2 U4.35(KEY_IN)
NetR51_2: R51.2 S4.1(A1)
NetR52_1: R52.1 U4.3(IN_LS)
NetR53_2: R53.2 U4.34(REXT)
NetR54_1: R54.1 U4.5(TX_2)
NetR57_2: R57.2 TP61.1 U4.13(CAN_L) ; port CAN_L
NetR58_2: R58.2 TP62.1 U4.14(CAN_H) ; port CAN_H
NetTP54_1: TP54.1 U4.6(MTX_1) ; port K-line-TX
NetTP59_1: TP59.1 U4.11(RX_CAN) ; port CAN_RX

Not connected (* = marked no-connect by the designer): S4 2(A2) 3(B2); U4 2(Out_LS) 4(MTX_2)* 8(Key_2)* 19(V_SUPPLY_BAT)* 21(NC)* 23(GAIN_A)* 24(NC) 25(GAIN_B)* 26(NC)* 27(OUT_OP)* 28(INM_OP)* 29(INP_OP)* 30(OUT_VRS)

### Notes on the sheet
- Labels drawn without touching a wire or pin: VCC

### Library data of the parts
C31-C34 = Cap: LOW ESR; Published: 8-Jun-2000; LatestRevisionDate: 17-Jul-2002; LatestRevisionNote: Re-released for DXP Platform.; PackageReference: RAD-0.3; Publisher: Altium Limited; PackageDescription: Radial Cap, Thru-Hole; 2 Leads; 0.3 in Pin Spacing
  C31: Value: 4.7nF
  C32 C33: Value: 100nF
  C34: Value: 1nF
R50-R60 R77 = Res1: Resistor; Published: 8-Jun-2000; LatestRevisionDate: 17-Jul-2002; LatestRevisionNote: Re-released for DXP Platform.; PackageReference: AXIAL-0.3; Publisher: Altium Limited; PackageDescription: Axial Device, Thru-Hole; 2 Leads; 0.3 in Pin Spacing
  R50: Value: 20K
  R51: Value: 3K
  R52 R54 R60: Value: 10K
  R53: Value: 27K
  R55: Value: 100K
  R56: Value: 1K
  R57 R58: Value: 60.4R
  R59: Value: 47K
  R77: Value: 4.7k
S4 = SW DIP-2: DIP Switch, 2 Position, SPST; Published: 24-Mar-1999; LatestRevisionDate: 17-Jul-2002; LatestRevisionNote: Re-released for DXP Platform.; PackageReference: DIP-4; Publisher: Altium Limited

## Sheet Power.SchDoc
size A; SheetNumber: 6; SheetTotal: 8; SPICEModelCacheOOHVENGF: <root> / <DocumentId>OOHVENGF</DocumentId> / <CacheFrame Number="0"> / <Model Name="led0" Kind="MDL"> / <Text>*Typ INFRARED GaAs LED: Vf=1.2V Vr=5V If=40mA trr=3uS / *LED Pinout: 1=A, 2=K / .MODEL LED0 D (IS=93.5P RS=84M N=2.63 BV=5 IBV=10U / + CJO=2.97P VJ=.75 M=.333 TT=4.32U)</Text> / </Model> / <Model Name="diode" Kind="MDL"> / <Text>*Default Diode / *Diode Pinout: A,K / .MODEL DIODE D()</Text> / </Model> / </CacheFrame> / </root>
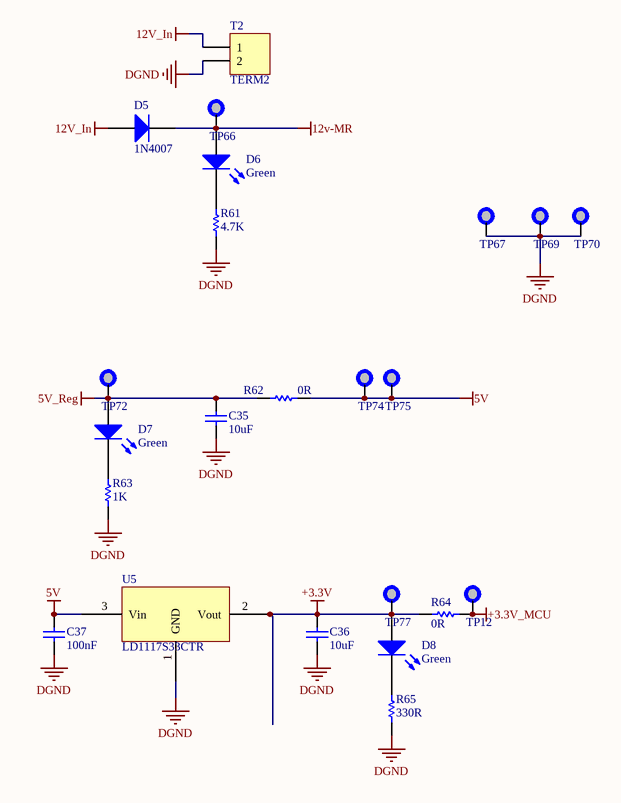
[diagram p5: Power.SchDoc]

### Parts
C35  value 10uF  [1206C]  (hidden comment: 10uF/50V)
C36  value 10uF  [1206C]  (hidden comment: 10uF/50V)
C37  100nF  [0603c]
D5  1N4007  [SMC]
D6  Green  [0805LED]
D7  Green  [0805LED]
D8  Green  [0805LED]
R61  4.7K  [0805]
R62  0R  [1206]
R63  1K  [0805]
R64  0R  [1206]
R65  330R  [0805]
T2  TERM2  [term2]
TP12  TestPoint  [TP]  (value not drawn)
TP66  TestPoint  [TP]  (value not drawn)
TP67  TestPoint  [TP]  (value not drawn)
TP69  TestPoint  [TP]  (value not drawn)
TP70  TestPoint  [TP]  (value not drawn)
TP72  TestPoint  [TP]  (value not drawn)
TP74  TestPoint  [TP]  (value not drawn)
TP75  TestPoint  [TP]  (value not drawn)
TP77  TestPoint  [TP]  (value not drawn)
U5  LD1117S33CTR  [sot223]

### Nets
5V: C37.1 R62.2 TP74.1 TP75.1 U5.3(Vin)
5V_Reg: C35.2 D7.1(A) R62.1 TP72.1
12v-MR: D5.2(K) D6.1(A) TP66.1
12V_In: D5.1(A) T2.1
+3.3V: C36.2 D8.1(A) R64.1 TP77.1 U5.2(Vout) U5.4(Vout)
+3.3V_MCU: R64.2 TP12.1
DGND: C35.1 C36.1 C37.2 R61.1 R63.1 R65.1 T2.2 TP67.1 TP69.1 TP70.1 U5.1(GND)
NetD6_2: D6.2(K) R61.2
NetD7_2: D7.2(K) R63.2
NetD8_2: D8.2(K) R65.2

### Library data of the parts
C35-C37 = Cap: LOW ESR; Published: 8-Jun-2000; LatestRevisionDate: 17-Jul-2002; LatestRevisionNote: Re-released for DXP Platform.; PackageReference: RAD-0.3; Publisher: Altium Limited; PackageDescription: Radial Cap, Thru-Hole; 2 Leads; 0.3 in Pin Spacing
  C37: Value: 100nF
D5 = Diode: Published: 8-Jun-2000; LatestRevisionDate: 17-Jul-2002; LatestRevisionNote: Re-released for DXP Platform.; PackageVersion: Sep-1996; PackageReference: SMC; Publisher: Altium Limited; PackageDescription: DO-214-AB/SMC; 2 C-Bend Leads; Body 7.9 x 5.9 mm, inc. leads (LxW); Code_JEDEC: DO-214-AB; Value: 1N4007
D6-D8 = LED0: Published: 8-Jun-2000; LatestRevisionDate: 08-Jul-2005; LatestRevisionNote: Mech Layer 1 removed.; PackageReference: LED-0; Publisher: Altium Limited; PackageDescription: LED; 2 Leads
R61-R65 = Res1: Resistor; Published: 8-Jun-2000; LatestRevisionDate: 17-Jul-2002; LatestRevisionNote: Re-released for DXP Platform.; PackageReference: AXIAL-0.3; Publisher: Altium Limited; PackageDescription: Axial Device, Thru-Hole; 2 Leads; 0.3 in Pin Spacing
  R61: Value: 4.7K
  R62 R64: Value: 0R
  R63: Value: 1K
  R65: Value: 330R
T2 = Header 2: Header, 2-Pin; LatestRevisionDate: 17-Jul-2002; LatestRevisionNote: Re-released for DXP Platform.; Publisher: Altium Limited
U5 = AMS1117

## Sheet TLE8209-2SA.SchDoc
size A4; SheetNumber: 7; SheetTotal: 8
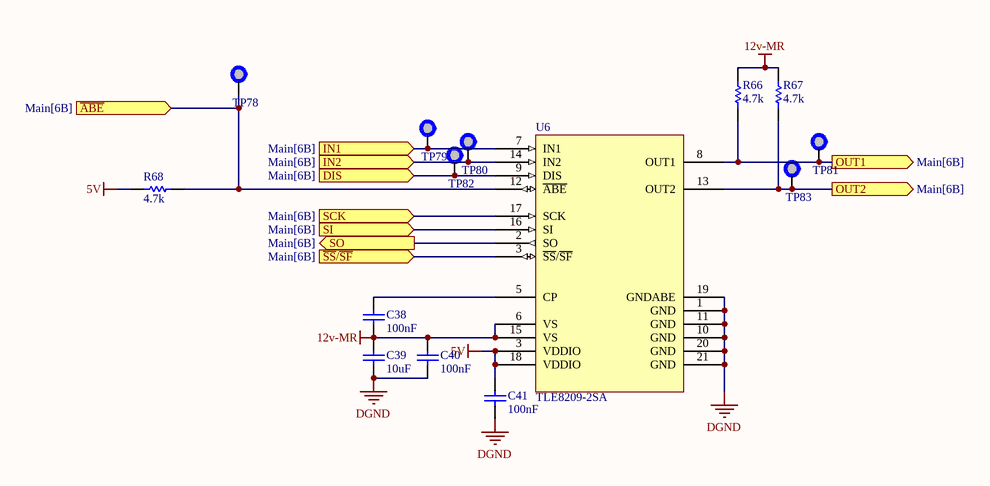
[diagram p6: TLE8209-2SA.SchDoc]

### Parts
C38  100nF  [0603c]
C39  value 10uF  [1206C]  (hidden comment: 10uf/50V)
C40  100nF  [0603c]
C41  100nF  [0603c]
R66  4.7K  [0805]
R67  4.7K  [0805]
R68  4.7K  [0805]
TP78  TestPoint  [TP]  (value not drawn)
TP79  TestPoint  [TP]  (value not drawn)
TP80  TestPoint  [TP]  (value not drawn)
TP81  TestPoint  [TP]  (value not drawn)
TP82  TestPoint  [TP]  (value not drawn)
TP83  TestPoint  [TP]  (value not drawn)
U6  TLE8209-2SA  [TLE8209-2SA]

### Ports
DIS (in, see Main[6B]), IN1 (in, see Main[6B]), IN2 (in, see Main[6B]), OUT1 (out, see Main[6B]), OUT2 (out, see Main[6B]), SCK (in, see Main[6B]), SI (in, see Main[6B]), SO (out, see Main[6B]), ~{ABE} (in, see Main[6B]), ~{SS}/~{SF} (in, see Main[6B])

### Nets
5V: C41.1 R68.1 U6.3(VDDIO) U6.18(VDDIO)
12v-MR: C38.2 C39.2 C40.1 R66.1 R67.1 U6.6(VS) U6.15(VS)
DGND: C39.1 C40.2 C41.2 U6.1(GND) U6.10(GND) U6.11(GND) U6.19(GNDABE) U6.20(GND) U6.21(GND)
DIO19: TP79.1 U6.7(IN1) ; port IN1
DIO20: TP80.1 U6.14(IN2) ; port IN2
DIO21: TP82.1 U6.9(DIS) ; port DIS
DIO22: R68.2 TP78.1 U6.12(~{ABE}) ; port ~{ABE}
NetC38_1: C38.1 U6.5(CP)
NetP4_19: R66.2 TP81.1 U6.8(OUT1) ; port OUT1
NetP4_20: R67.2 TP83.1 U6.13(OUT2) ; port OUT2
NetTP44_1: U6.3(~{SS}/~{SF}) ; port ~{SS}/~{SF}
NetTP45_1: U6.17(SCK) ; port SCK
NetTP46_1: U6.16(SI) ; port SI
NetTP47_1: U6.2(SO) ; port SO

### Library data of the parts
C38 C40 C41 = Cap: LOW ESR; Published: 8-Jun-2000; LatestRevisionDate: 17-Jul-2002; LatestRevisionNote: Re-released for DXP Platform.; PackageReference: RAD-0.3; Publisher: Altium Limited; PackageDescription: Radial Cap, Thru-Hole; 2 Leads; 0.3 in Pin Spacing; Value: 100nF
C39 = Cap: Low ESR; Published: 8-Jun-2000; LatestRevisionDate: 17-Jul-2002; LatestRevisionNote: Re-released for DXP Platform.; PackageReference: RAD-0.3; Publisher: Altium Limited; PackageDescription: Radial Cap, Thru-Hole; 2 Leads; 0.3 in Pin Spacing
R66-R68 = Res1: Resistor; Published: 8-Jun-2000; LatestRevisionDate: 17-Jul-2002; LatestRevisionNote: Re-released for DXP Platform.; PackageReference: AXIAL-0.3; Publisher: Altium Limited; PackageDescription: Axial Device, Thru-Hole; 2 Leads; 0.3 in Pin Spacing; Value: 4.7k

## Sheet STM8.SchDoc
size A4; SheetNumber: 8; SheetTotal: 8; SPICEModelCacheLETLOLHH: <root> / <DocumentId>LETLOLHH</DocumentId> / <CacheFrame Number="0"> / <Model Name="led0" Kind="MDL"> / <Text>*Typ INFRARED GaAs LED: Vf=1.2V Vr=5V If=40mA trr=3uS / *LED Pinout: 1=A, 2=K / .MODEL LED0 D (IS=93.5P RS=84M N=2.63 BV=5 IBV=10U / + CJO=2.97P VJ=.75 M=.333 TT=4.32U)</Text> / </Model> / </CacheFrame> / </root>
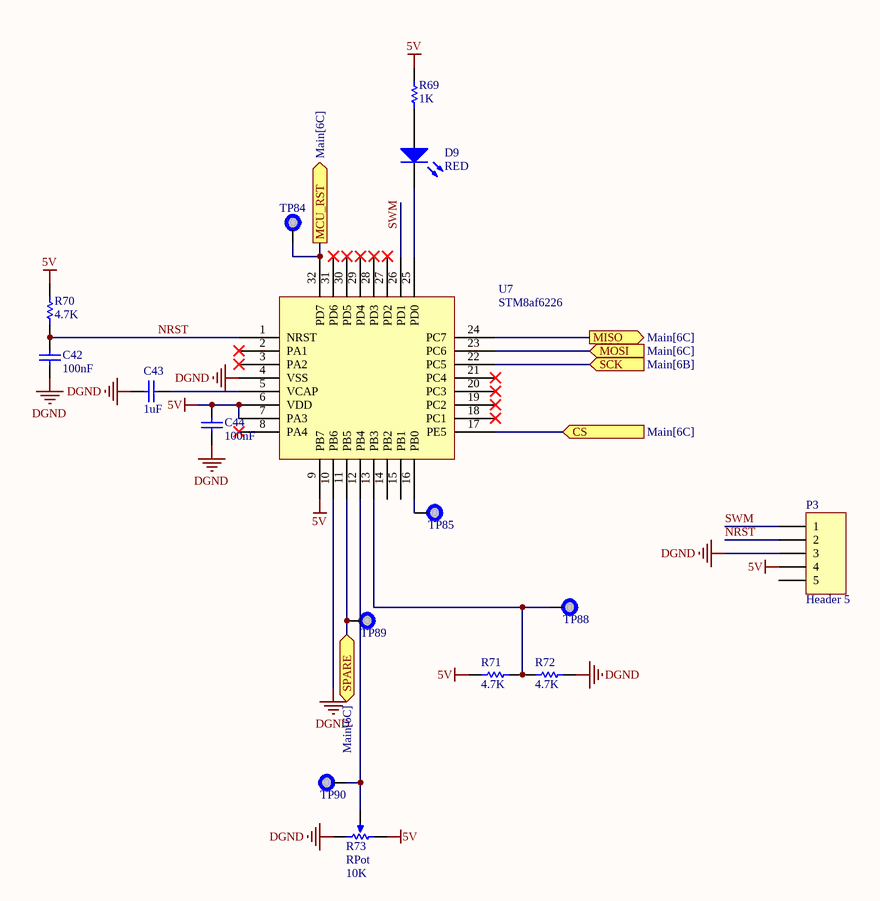
[diagram p7: STM8.SchDoc]

### Parts
C42  100nF  [0603c]
C43  1uF  [0805c]
C44  100nF  [0603c]
D9  RED  [0805LED]
P3  Header 5  [HDR1X5]
R69  1K  [0805]
R70  4.7K  [0805]
R71  4.7K  [0805]
R72  4.7K  [0805]
R73  RPot  value 10K  [POT-MULTITURN]
TP84  TestPoint  [TP]  (value not drawn)
TP85  TestPoint  [TP]  (value not drawn)
TP88  TestPoint  [TP]  (value not drawn)
TP89  TestPoint  [TP]  (value not drawn)
TP90  TestPoint  [TP]  (value not drawn)
U7  STM8af6226  [LQFP-32]

### Ports
CS (in, see Main[6C]), MCU_RST (out, see Main[6C]), MISO (out, see Main[6C]), MOSI (in, see Main[6C]), SCK (in, see Main[6B]), SPARE (bidir, see Main[6C])

### Nets
5V: C44.1 P3.4 R69.2 R70.1 R71.2 R73.1(TOP) U7.6(VDD) U7.7(PA3) U7.9(PB7)
DGND: C42.2 C43.2 C44.2 P3.3 R72.1 R73.3(BOT) U7.4(VSS) U7.10(PB6)
DIO23: TP84.1 U7.32(PD7) ; port MCU_RST
DIO24: TP89.1 U7.11(PB5) ; port SPARE
NRST: C42.1 P3.2 R70.2 U7.1(NRST)
SWM: P3.1 U7.26(PD1)
NetC43_1: C43.1 U7.5(VCAP)
NetD9_1: D9.1(A) R69.1
NetD9_2: D9.2(K) U7.25(PD0)
NetR38_1: U7.22(PC5) ; port SCK
NetR39_1: U7.23(PC6) ; port MOSI
NetR40_2: U7.17(PE5) ; port CS
NetR71_1: R71.1 R72.2 TP88.1 U7.13(PB3)
NetR73_2: R73.2(TAP) TP90.1 U7.12(PB4)
NetTP50_1: U7.24(PC7) ; port MISO
NetTP85_1: TP85.1 U7.16(PB0)

Not connected (* = marked no-connect by the designer): P3 5; U7 2(PA1)* 3(PA2)* 8(PA4)* 14(PB2) 15(PB1) 18(PC1)* 19(PC2)* 20(PC3)* 21(PC4)* 27(PD2)* 28(PD3)* 29(PD4)* 30(PD5)* 31(PD6)*

### Library data of the parts
C42-C44 = Cap: LOW ESR; Published: 8-Jun-2000; LatestRevisionDate: 17-Jul-2002; LatestRevisionNote: Re-released for DXP Platform.; PackageReference: RAD-0.3; Publisher: Altium Limited; PackageDescription: Radial Cap, Thru-Hole; 2 Leads; 0.3 in Pin Spacing
  C42 C44: Value: 100nF
  C43: Value: 1uF
D9 = LED0: Published: 8-Jun-2000; LatestRevisionDate: 08-Jul-2005; LatestRevisionNote: Mech Layer 1 removed.; PackageReference: LED-0; Publisher: Altium Limited; PackageDescription: LED; 2 Leads
P3 = Header 5: Header, 5-Pin; LatestRevisionDate: 17-Jul-2002; LatestRevisionNote: Re-released for DXP Platform.; Publisher: Altium Limited
R69-R72 = Res1: Resistor; Published: 8-Jun-2000; LatestRevisionDate: 17-Jul-2002; LatestRevisionNote: Re-released for DXP Platform.; PackageReference: AXIAL-0.3; Publisher: Altium Limited; PackageDescription: Axial Device, Thru-Hole; 2 Leads; 0.3 in Pin Spacing
  R69: Value: 1K
  R70-R72: Value: 4.7K
R73 = RPot: as R5 on sheet MCU; Published: 8-Jun-2000; LatestRevisionDate: 17-Jul-2002; LatestRevisionNote: Re-released for DXP Platform.; PackageReference: VR5; Publisher: Altium Limited; PackageDescription: Variable Resistor, Thru-Hole; 3 Leads

## Nets that join several sheets
5V: Main (12 pins), TPIC8101DW (C24.1 U2.1), TLE6244x (5 pins), L9741 (R56.2 R60.1), Power (5 pins), TLE8209-2SA (C41.1 R68.1 U6.3 U6.18), STM8 (9 pins)
5V_Reg: L9741 (U4.18), Power (C35.2 D7.1 R62.1 TP72.1)
12v-MR: Main (T1.2), TLE6244x (19 pins), L9741 (R55.1 S4.4 U4.17), Power (D5.2 D6.1 TP66.1), TLE8209-2SA (7 pins)
+3.3V_MCU: MCU (42 pins), Power (R64.2 TP12.1)
DGND: Main (T1.1), MCU (38 pins), TPIC8101DW (8 pins), TLE6244x (11 pins), L9741 (11 pins), Power (11 pins), TLE8209-2SA (9 pins), STM8 (8 pins)
DIO23: Main (R45.2), STM8 (TP84.1 U7.32)
DIO24: Main (R46.2), STM8 (TP89.1 U7.11)
DIO25: Main (R47.2), TPIC8101DW (TP5.1 U2.7)
DIO26: Main (R48.2), L9741 (R56.1 TP55.1 U4.31)
DIO27: Main (R49.2), L9741 (TP53.1 U4.36)
NetC25_1: MCU (U1.40), TPIC8101DW (C25.1 TP4.1)
NetC32_1: Main (T1.4), L9741 (C32.1 R55.2 TP56.1 U4.7)
NetP4_19: Main (P4.19), TLE8209-2SA (R66.2 TP81.1 U6.8)
NetP4_20: Main (P4.20), TLE8209-2SA (R67.2 TP83.1 U6.13)
NetR2_1: MCU (R2.1), L9741 (R60.2 TP65.1 U4.20)
NetR17_1: MCU (U1.37), TPIC8101DW (R17.1 R18.2 TP6.1)
NetR38_1: Main (R38.1 TP48.1), MCU (U1.74), TPIC8101DW (U2.13), STM8 (U7.22)
NetR39_1: Main (R39.1 TP49.1), MCU (U1.76), TPIC8101DW (U2.12), STM8 (U7.23)
NetR40_2: Main (R40.2 TP51.1), MCU (U1.77), STM8 (U7.17)
NetR41_1: Main (R41.1 TP52.1), MCU (U1.73), TPIC8101DW (U2.8)
NetR42_1: Main (R42.1), MCU (U1.122), L9741 (TP57.1 U4.9)
NetR43_1: Main (R43.1), MCU (U1.104), L9741 (TP60.1 U4.12)
NetR44_1: Main (R44.1 TP9.1), MCU (U1.82)
NetR44_2: Main (R44.2 TP10.1), MCU (U1.81)
NetR57_2: Main (T1.6), L9741 (R57.2 TP61.1 U4.13)
NetR58_2: Main (T1.5), L9741 (R58.2 TP62.1 U4.14)
NetTP43_1: Main (TP43.1), MCU (U1.129), TLE6244x (U3.56)
NetTP44_1: Main (TP44.1), MCU (U1.128), TLE8209-2SA (U6.3)
NetTP45_1: Main (TP45.1), MCU (U1.133), TLE6244x (U3.54), TLE8209-2SA (U6.17)
NetTP46_1: Main (TP46.1), MCU (U1.135), TLE6244x (U3.55), TLE8209-2SA (U6.16)
NetTP47_1: Main (TP47.1), MCU (U1.134), TLE6244x (U3.53), TLE8209-2SA (U6.2)
NetTP50_1: Main (TP50.1), MCU (U1.75), TPIC8101DW (U2.11), STM8 (U7.24)
NetTP54_1: MCU (U1.119), L9741 (TP54.1 U4.6)
NetTP59_1: MCU (U1.103), L9741 (TP59.1 U4.11)